# Altium project PROJECT_W-F-FC-H2XX.PrjPcb
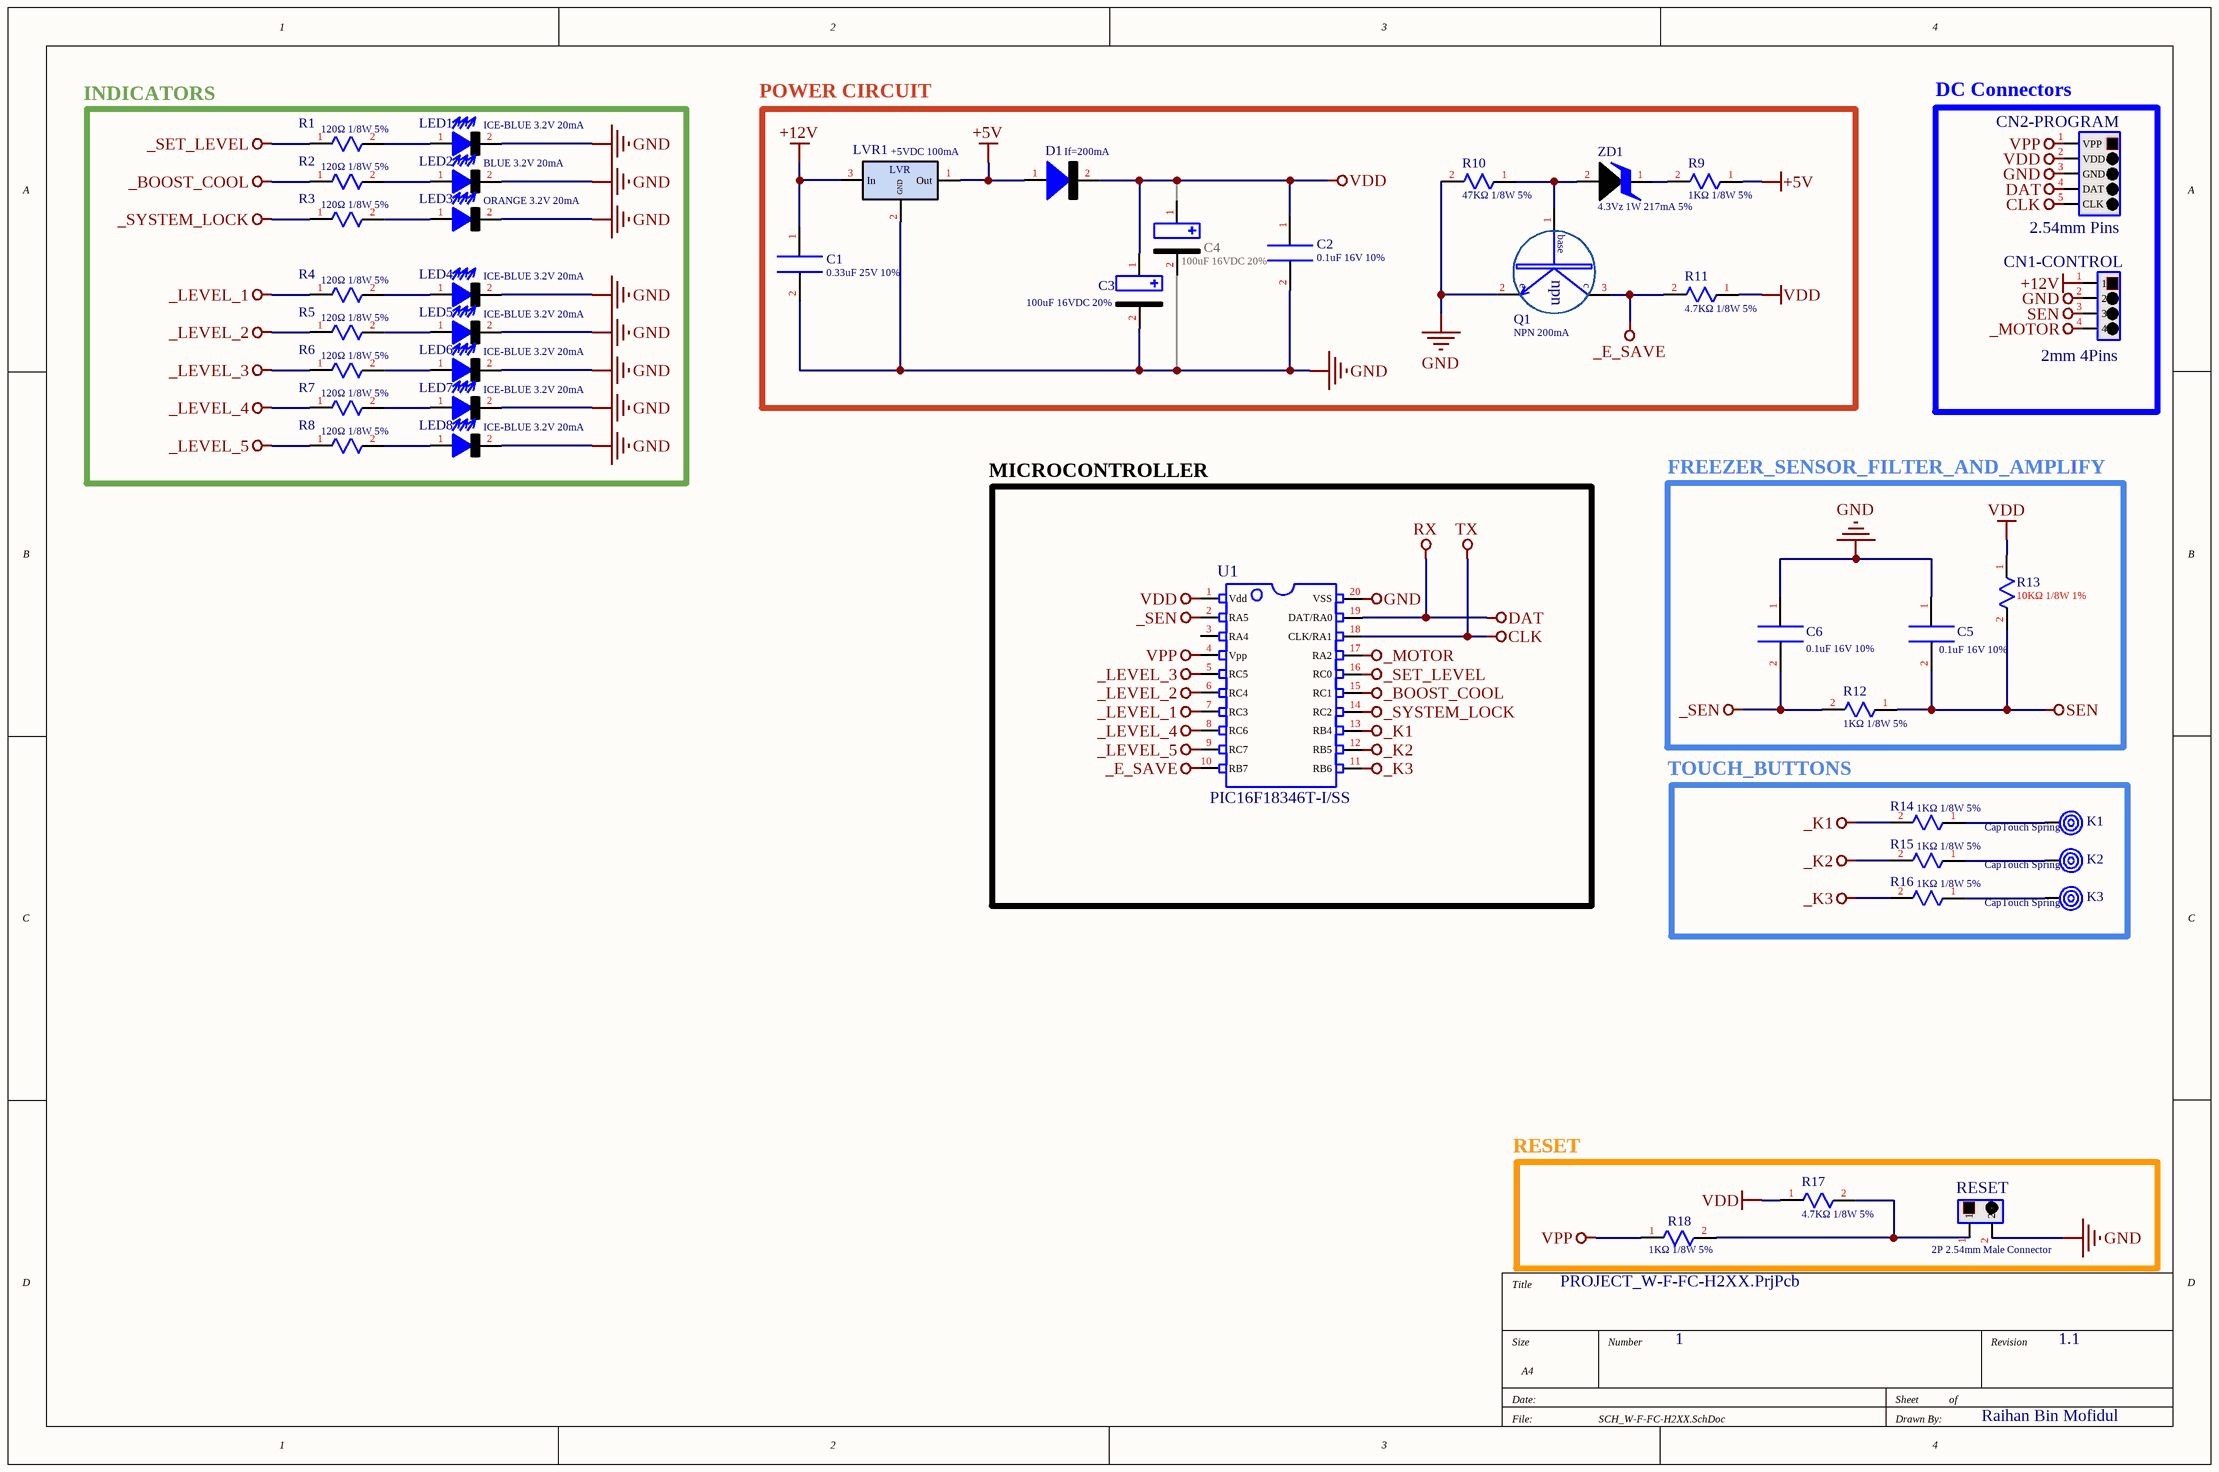
[diagram p0: SCH_W-F-FC-H2XX.SchDoc]
1 sheet, 43 parts. Net scope: global (net labels, ports and power ports of the same name join across sheets).
Board file: PCB_W-F-FC-H2XX.PcbDoc

## Sheet SCH_W-F-FC-H2XX.SchDoc
size A4

### Parts
C1  0.33uF 25V 10%  [C_0805]
C2  0.1uF 16V 10%  [C_0805]
C3  100uF 16VDC 20%  [C_SMD_6.3X5.4_CK-100uF-16V]
C4  100uF 16VDC 20%  [C_Radial_P2_Right_Angle_without_3d]
C5  0.1uF 16V 10%  [C_0805]
C6  0.1uF 16V 10%  [C_0805]
CN1-CONTROL  2mm 4Pins  [CN_4P_A2001WR-S-XP-LCP]
CN2-PROGRAM  2.54mm Pins  [CN_PIC_MCU_Debugger_Straight]
D1  If=200mA  [D_SOT-23-3_200mA]
K1  CapTouch Spring  [K_TouchSpring-12H-9W-0.6&1.3D]
K2  CapTouch Spring  [K_TouchSpring-12H-9W-0.6&1.3D]
K3  CapTouch Spring  [K_TouchSpring-12H-9W-0.6&1.3D]
LED1  ICE-BLUE 3.2V 20mA  [LED_SMD3528]
LED2  BLUE 3.2V 20mA  [LED_SMD3528]
LED3  ORANGE 3.2V 20mA  [LED_SMD3528]
LED4  ICE-BLUE 3.2V 20mA  [LED_SMD3528]
LED5  ICE-BLUE 3.2V 20mA  [LED_SMD3528]
LED6  ICE-BLUE 3.2V 20mA  [LED_SMD3528]
LED7  ICE-BLUE 3.2V 20mA  [LED_SMD3528]
LED8  ICE-BLUE 3.2V 20mA  [LED_SMD3528]
LVR1  +5VDC 100mA  [U_CJ78L05_SOT89]
Q1  NPN 200mA  [Q_SOT-23-3_NPN_BC847]
R1  120Ω 1/8W 5%  [R_0805]
R2  120Ω 1/8W 5%  [R_0805]
R3  120Ω 1/8W 5%  [R_0805]
R4  120Ω 1/8W 5%  [R_0805]
R5  120Ω 1/8W 5%  [R_0805]
R6  120Ω 1/8W 5%  [R_0805]
R7  120Ω 1/8W 5%  [R_0805]
R8  120Ω 1/8W 5%  [R_0805]
R9  1KΩ 1/8W 5%  [R_0805]
R10  47KΩ 1/8W 5%  [R_0805]
R11  4.7KΩ 1/8W 5%  [R_0805]
R12  1KΩ 1/8W 5%  [R_0805]
R13  10KΩ 1/8W 1%  [R_0805]
R14  1KΩ 1/8W 5%  [R_0805]
R15  1KΩ 1/8W 5%  [R_0805]
R16  1KΩ 1/8W 5%  [R_0805]
R17  4.7KΩ 1/8W 5%  [R_0805]
R18  1KΩ 1/8W 5%  [R_0805]
RESET  2P 2.54mm Male Connector  [CN_PIC_MCU_Reseter_Straight]
U1  PIC16F18346T-I/SS  [U_PIC_20pin_SSOP]
ZD1  4.3Vz 1W 217mA 5%  [ZD_ZM4742A LL-41]

### Blocks framed on the sheet
INDICATORS: LED1-LED8 R1-R8
POWER CIRCUIT: C1-C4 D1 LVR1 Q1 R9-R11 ZD1
DC Connectors: CN1-CONTROL CN2-PROGRAM
MICROCONTROLLER: U1
FREEZER_SENSOR_FILTER_AND_AMPLIFY: C5 C6 R12 R13
TOUCH_BUTTONS: K1-K3 R14-R16
RESET: R17 R18 RESET

### Nets
+5V: D1.1(vdd) LVR1.1(Out) R9.1
+12V: C1.1 CN1-CONTROL.1 LVR1.3(In)
_BOOST_COOL: R2.1 U1.15(RC1)
_E_SAVE: Q1.3(Collector) R11.2 U1.10(RB7)
_K1: R14.2 U1.13(RB4)
_K2: R15.2 U1.12(RB5)
_K3: R16.2 U1.11(RB6)
_LEVEL_1: R4.1 U1.7(RC3)
_LEVEL_2: R5.1 U1.6(RC4)
_LEVEL_3: R6.1 U1.5(RC5)
_LEVEL_4: R7.1 U1.8(RC6)
_LEVEL_5: R8.1 U1.9(RC7)
_MOTOR: CN1-CONTROL.4 U1.17(RA2)
_SEN: C6.2 R12.2 U1.2(RA5)
_SET_LEVEL: R1.1 U1.16(RC0)
_SYSTEM_LOCK: R3.1 U1.14(RC2)
CLK: CN2-PROGRAM.5(CLK) U1.18(CLK/RA1)  [also labelled TX]
DAT: CN2-PROGRAM.4(DAT) U1.19(DAT/RA0)  [also labelled RX]
GND: C1.2 C2.2 C3.2(vss) C4.2(vss) C5.1 C6.1 CN1-CONTROL.2 CN2-PROGRAM.3(GND) LED1.2(vss) LED2.2(vss) LED3.2(vss) LED4.2(vss) LED5.2(vss) LED6.2(vss) LED7.2(vss) LED8.2(vss) LVR1.2(GND) Q1.2(Emitter) R10.2 RESET.2 U1.20(VSS)
SEN: C5.2 CN1-CONTROL.3 R12.1 R13.2
VDD: C2.1 C3.1(vdd) C4.1(vdd) CN2-PROGRAM.2(VDD) D1.2(vss) R11.1 R13.1 R17.1 U1.1(Vdd)
VPP: CN2-PROGRAM.1(VPP) R18.1 U1.4(Vpp)
NetK1_1: K1.1 R14.1
NetK2_1: K2.1 R15.1
NetK3_1: K3.1 R16.1
NetLED1_1: LED1.1(vdd) R1.2
NetLED2_1: LED2.1(vdd) R2.2
NetLED3_1: LED3.1(vdd) R3.2
NetLED4_1: LED4.1(vdd) R4.2
NetLED5_1: LED5.1(vdd) R5.2
NetLED6_1: LED6.1(vdd) R6.2
NetLED7_1: LED7.1(vdd) R7.2
NetLED8_1: LED8.1(vdd) R8.2
NetQ1_1: Q1.1(Base) R10.1 ZD1.2(GND)
NetR9_2: R9.2 ZD1.1(VCC)
NetR17_2: R17.2 R18.2 RESET.1

Not connected (* = marked no-connect by the designer): U1 3(RA4)

### Notes on the sheet
- 1
- 1.1
- Raihan Bin Mofidul
- (in symbol BJT_npn) base; npn; e; c
- (in symbol Voltage Regulator) LVR

### Library data of the parts
C1 C2 C5 C6 = Capacitor Non-Polar: Multilayer Ceramic Capacitors, SMD 0805
C3 = Capacitor Polar: Aluminum Electrolytic Capacitor, SMD ØDxL=6.3x5.4mm
C4 = Capacitor Polar: Aluminum Electrolytic Capacitor, Through Hole, ØDxL=5*11mm Pitch=2mm
CN1-CONTROL = Connector_4PINs: A2001WR-S-XP-LCP
CN2-PROGRAM = Connector_PIC_Burn
D1 = Diode: BAS19
K1-K3 = Touch_Spring: ØDxL=9x12mm LeadDia=0.6mm
LED1 LED4-LED8 = LED: WEJT28AC0-E74P01, SMD 3528
LED2 = LED: WEJT28ABV-BCDP01, SMD 3528
LED3 = LED: WEJT28AAV-6ACP01, SMD 3528
LVR1 = Voltage Regulator: SOT-89-3L Plastic-Encapsulate Voltage Regulator
Q1 = BJT_npn: BC847, SOT-23-3
R1-R18 = Resistor: Chip-Resistor, SMD 0805, , RoHS
RESET = Connector_2PINs
U1 = IC_PIC_20pins
ZD1 = Zener Diode: ZM4731, MELF SILICON PLANAR POWER ZENER DIODES, LL-41